# Altium schematic sheet MotorControl.SchDoc
size A4
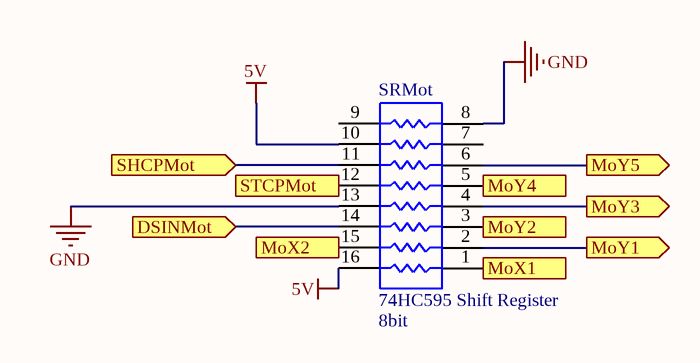
[diagram p0: MotorControl.SchDoc]

## Parts
SRMot  74HC595 Shift Register  value 8bit  [SO-16_L]

## Ports
DSINMot (in), MoX1 (out), MoX2 (out), MoY1 (out), MoY2 (out), MoY3 (out), MoY4 (out), MoY5 (out), SHCPMot (in), STCPMot (in)

## Nets
5V: SRMot.10 SRMot.16
GND: SRMot.8 SRMot.13
DSINMot: SRMot.14 ; port DSINMot
MoX1: SRMot.1 ; port MoX1
MoX2: SRMot.15 ; port MoX2
MoY1: SRMot.2 ; port MoY1
MoY2: SRMot.3 ; port MoY2
MoY3: SRMot.4 ; port MoY3
MoY4: SRMot.5 ; port MoY4
MoY5: SRMot.6 ; port MoY5
SHCPMot: SRMot.11 ; port SHCPMot
STCPMot: SRMot.12 ; port STCPMot

Not connected (* = marked no-connect by the designer): SRMot 7 9

## Notes on the sheet
- Title
- Size:
- Date:
- A4
- Number:
- Time:
- Revision:
- Sheet
- of
- File:

## Library data of the parts
SRMot = Res Pack3: Isolated Resistor Network; Published: 24-Mar-1999; LatestRevisionDate: 29-May-2009; LatestRevisionNote: IPC-7351 Footprint Added.; PackageReference: SO-16; Publisher: Altium Limited; PackageDescription: 16-Pin Small Outline Integrated Circuit 1.27 mm Pitch; Code_JEDEC: MS-012-AC; Code_IPC: SOIC127P600-16